# Altium schematic sheet AnalogCapture.SchDoc: Analog Capture
size A; DocumentNumber: 3; SheetNumber: 3; SheetTotal: 9
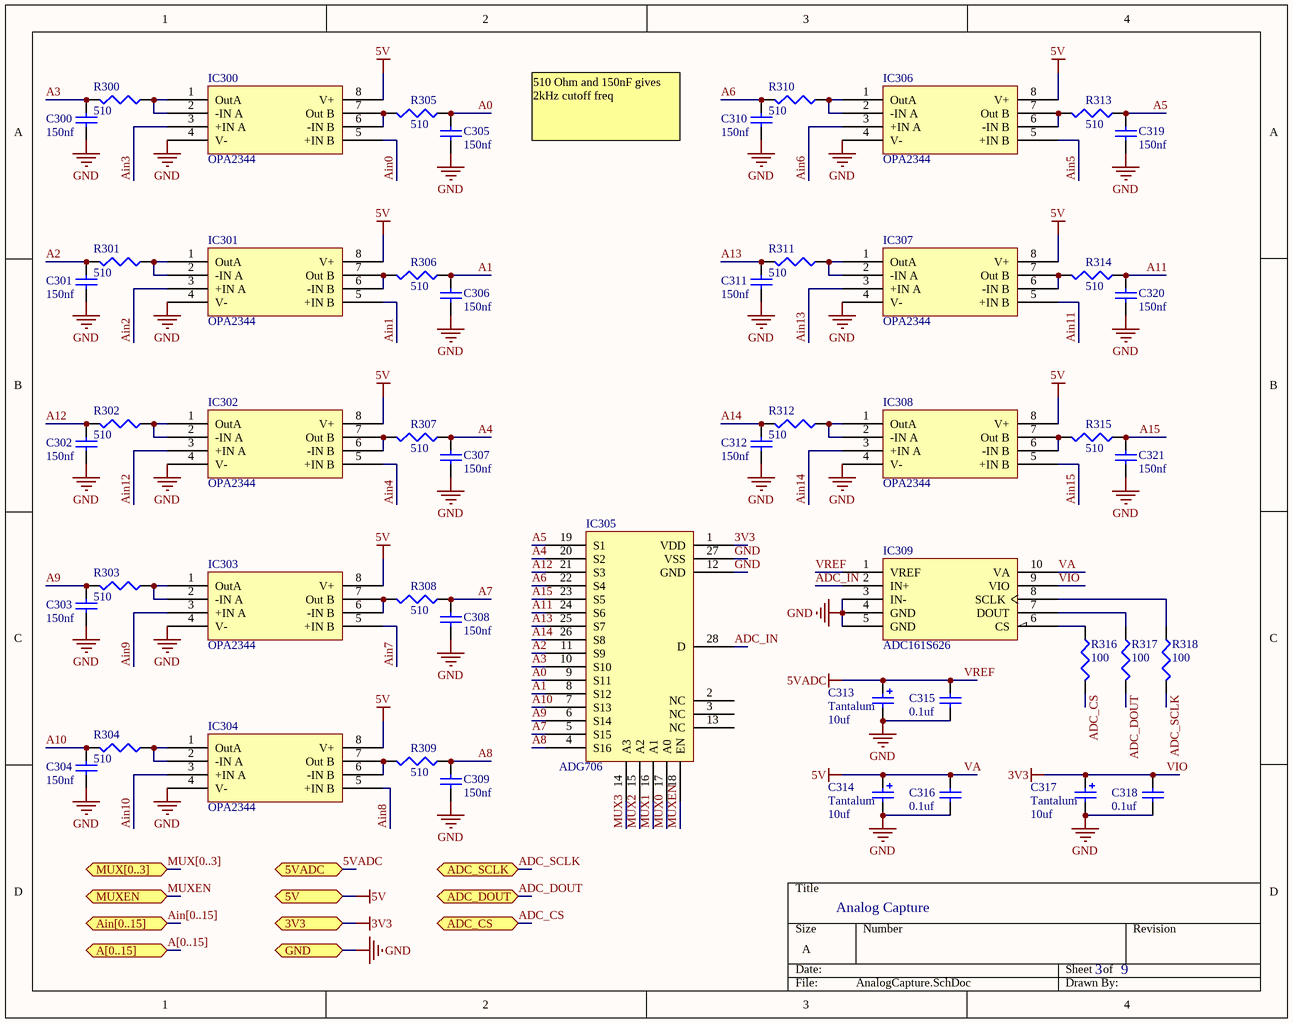
[diagram p0: AnalogCapture.SchDoc]

## Parts
C300  value 150nf  [SMD0603]  (hidden comment: Cap)
C301  value 150nf  [SMD0603]  (hidden comment: Cap)
C302  value 150nf  [SMD0603]  (hidden comment: Cap)
C303  value 150nf  [SMD0603]  (hidden comment: Cap)
C304  value 150nf  [SMD0603]  (hidden comment: Cap)
C305  value 150nf  [SMD0603]  (hidden comment: Cap)
C306  value 150nf  [SMD0603]  (hidden comment: Cap)
C307  value 150nf  [SMD0603]  (hidden comment: Cap)
C308  value 150nf  [SMD0603]  (hidden comment: Cap)
C309  value 150nf  [SMD0603]  (hidden comment: Cap)
C310  value 150nf  [SMD0603]  (hidden comment: Cap)
C311  value 150nf  [SMD0603]  (hidden comment: Cap)
C312  value 150nf  [SMD0603]  (hidden comment: Cap)
C313  Tantalum  value 10uf  [SMD1206 Polarized]
C314  Tantalum  value 10uf  [SMD1206 Polarized]
C315  value 0.1uf  [SMD0603]  (hidden comment: Capacitor Ceramic)
C316  value 0.1uf  [SMD0603]  (hidden comment: Capacitor Ceramic)
C317  Tantalum  value 10uf  [SMD1206 Polarized]
C318  value 0.1uf  [SMD0603]  (hidden comment: Capacitor Ceramic)
C319  value 150nf  [SMD0603]  (hidden comment: Cap)
C320  value 150nf  [SMD0603]  (hidden comment: Cap)
C321  value 150nf  [SMD0603]  (hidden comment: Cap)
IC300  OPA2344  [SOIC-8]
IC301  OPA2344  [SOIC-8]
IC302  OPA2344  [SOIC-8]
IC303  OPA2344  [SOIC-8]
IC304  OPA2344  [SOIC-8]
IC305  ADG706  [TSSOP-28]
IC306  OPA2344  [SOIC-8]
IC307  OPA2344  [SOIC-8]
IC308  OPA2344  [SOIC-8]
IC309  ADC161S626  [VSSOP-10 (DGS)]
R300  value 510  [SMD0603]  (hidden comment: Res)
R301  value 510  [SMD0603]  (hidden comment: Res)
R302  value 510  [SMD0603]  (hidden comment: Res)
R303  value 510  [SMD0603]  (hidden comment: Res)
R304  value 510  [SMD0603]  (hidden comment: Res)
R305  value 510  [SMD0603]  (hidden comment: Res)
R306  value 510  [SMD0603]  (hidden comment: Res)
R307  value 510  [SMD0603]  (hidden comment: Res)
R308  value 510  [SMD0603]  (hidden comment: Res)
R309  value 510  [SMD0603]  (hidden comment: Res)
R310  value 510  [SMD0603]  (hidden comment: Res)
R311  value 510  [SMD0603]  (hidden comment: Res)
R312  value 510  [SMD0603]  (hidden comment: Res)
R313  value 510  [SMD0603]  (hidden comment: Res)
R314  value 510  [SMD0603]  (hidden comment: Res)
R315  value 510  [SMD0603]  (hidden comment: Res)
R316  value 100  [SMD0603]  (hidden comment: Res)
R317  value 100  [SMD0603]  (hidden comment: Res)
R318  value 100  [SMD0603]  (hidden comment: Res)

## Ports
3V3, 5V, 5VADC, A[0..15], ADC_CS, ADC_DOUT, ADC_SCLK, Ain[0..15], GND, MUX[0..3], MUXEN

## Nets
3V3: C317.1 C318.2 IC305.1(VDD) IC309.9(VIO) ; port 3V3  [also labelled VIO]
5VADC: C313.1 C315.2 IC309.1(VREF) ; port 5VADC  [also labelled VREF]
GND: C300.2 C301.2 C302.2 C303.2 C304.2 C305.1 C306.1 C307.1 C308.1 C309.1 C310.2 C311.2 C312.2 C313.2 C314.2 C315.1 C316.1 C317.2 C318.1 C319.1 C320.1 C321.1 IC300.4(V-) IC301.4(V-) IC302.4(V-) IC303.4(V-) IC304.4(V-) IC305.12(GND) IC305.27(VSS) IC306.4(V-) IC307.4(V-) IC308.4(V-) IC309.3(IN-) IC309.4(GND) IC309.5(GND) ; port GND
VA: C314.1 C316.2 IC300.8(V+) IC301.8(V+) IC302.8(V+) IC303.8(V+) IC304.8(V+) IC306.8(V+) IC307.8(V+) IC308.8(V+) IC309.10(VA) ; port 5V  [also labelled 5V]
A0: C305.2 IC305.9(S11) R305.1
A1: C306.2 IC305.8(S12) R306.1
A2: C301.1 IC305.11(S9) R301.2
A3: C300.1 IC305.10(S10) R300.2
A4: C307.2 IC305.20(S2) R307.1
A5: C319.2 IC305.19(S1) R313.1
A6: C310.1 IC305.22(S4) R310.2
A7: C308.2 IC305.5(S15) R308.1
A8: C309.2 IC305.4(S16) R309.1
A9: C303.1 IC305.6(S14) R303.2
A10: C304.1 IC305.7(S13) R304.2
A11: C320.2 IC305.24(S6) R314.1
A12: C302.1 IC305.21(S3) R302.2
A13: C311.1 IC305.25(S7) R311.2
A14: C312.1 IC305.26(S8) R312.2
A15: C321.2 IC305.23(S5) R315.1
ADC_CS: R316.2 ; port ADC_CS
ADC_DOUT: R317.2 ; port ADC_DOUT
ADC_IN: IC305.28(D) IC309.2(IN+)
ADC_SCLK: R318.2 ; port ADC_SCLK
Ain0: IC300.5(+IN_B)
Ain1: IC301.5(+IN_B)
Ain2: IC301.3(+IN_A)
Ain3: IC300.3(+IN_A)
Ain4: IC302.5(+IN_B)
Ain5: IC306.5(+IN_B)
Ain6: IC306.3(+IN_A)
Ain7: IC303.5(+IN_B)
Ain8: IC304.5(+IN_B)
Ain9: IC303.3(+IN_A)
Ain10: IC304.3(+IN_A)
Ain11: IC307.5(+IN_B)
Ain12: IC302.3(+IN_A)
Ain13: IC307.3(+IN_A)
Ain14: IC308.3(+IN_A)
Ain15: IC308.5(+IN_B)
MUX0: IC305.17(A0)
MUX1: IC305.16(A1)
MUX2: IC305.15(A2)
MUX3: IC305.14(A3)
MUXEN: IC305.18(EN) ; port MUXEN
NetIC300_1: IC300.1(OutA) IC300.2(-IN_A) R300.1
NetIC300_6: IC300.6(-IN_B) IC300.7(Out_B) R305.2
NetIC301_1: IC301.1(OutA) IC301.2(-IN_A) R301.1
NetIC301_6: IC301.6(-IN_B) IC301.7(Out_B) R306.2
NetIC302_1: IC302.1(OutA) IC302.2(-IN_A) R302.1
NetIC302_6: IC302.6(-IN_B) IC302.7(Out_B) R307.2
NetIC303_1: IC303.1(OutA) IC303.2(-IN_A) R303.1
NetIC303_6: IC303.6(-IN_B) IC303.7(Out_B) R308.2
NetIC304_1: IC304.1(OutA) IC304.2(-IN_A) R304.1
NetIC304_6: IC304.6(-IN_B) IC304.7(Out_B) R309.2
NetIC306_1: IC306.1(OutA) IC306.2(-IN_A) R310.1
NetIC306_6: IC306.6(-IN_B) IC306.7(Out_B) R313.2
NetIC307_1: IC307.1(OutA) IC307.2(-IN_A) R311.1
NetIC307_6: IC307.6(-IN_B) IC307.7(Out_B) R314.2
NetIC308_1: IC308.1(OutA) IC308.2(-IN_A) R312.1
NetIC308_6: IC308.6(-IN_B) IC308.7(Out_B) R315.2
NetIC309_6: IC309.6(CS) R316.1
NetIC309_7: IC309.7(DOUT) R317.1
NetIC309_8: IC309.8(SCLK) R318.1

Not connected (* = marked no-connect by the designer): IC305 2(NC) 3(NC) 13(NC)

## Buses and harness runs
bus A[0..15] = port A[0..15]
bus Ain[0..15] = port Ain[0..15]
bus MUX[0..3] = port MUX[0..3]

## Notes on the sheet
- 510 Ohm and 150nF gives 2kHz cutoff freq

## Library data of the parts
C300-C312 C315 C316 C318-C321 = Capacitor Ceramic: Ceramic Chip Capacitor
C313 C314 C317 = Capacitor Polarized: Polarized Capacitor (Surface Mount)
IC300-IC304 IC306-IC308 = OPA2344: Rail to rail opamp
IC305 = ADG706: 16:1 Mux
IC309 = ADC161S626: TI ADC; 250ksps
R300-R318 = Resistor